# Altium project NeuroILO.PrjPcb
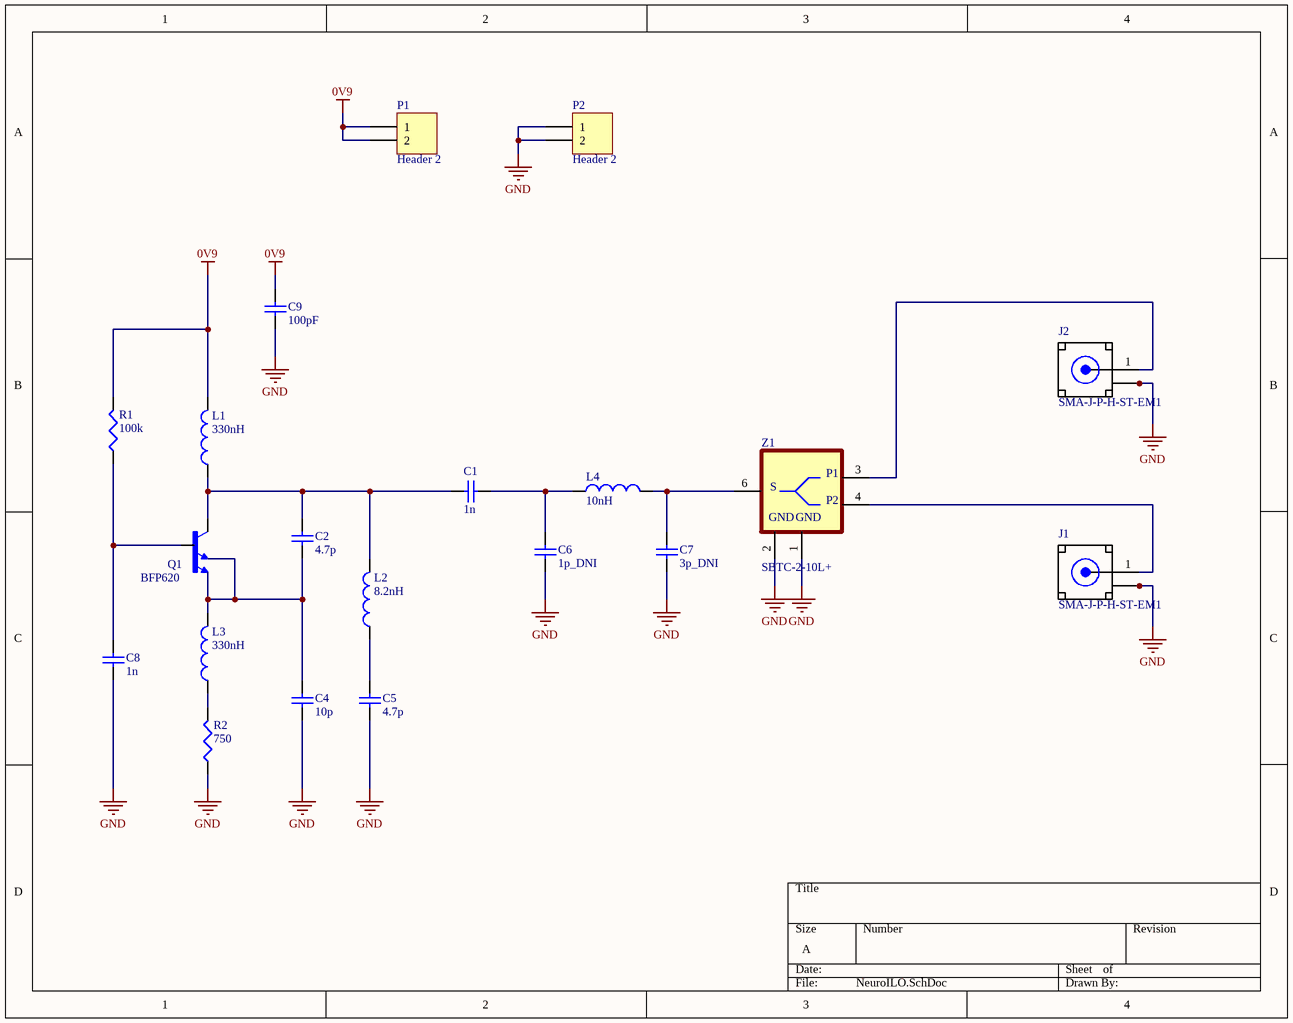
[diagram p0: NeuroILO.SchDoc]
1 sheet, 20 parts. Net scope: global (net labels, ports and power ports of the same name join across sheets).
Board file: neuroILO_C.PcbDoc

## Sheet NeuroILO.SchDoc
size A; SheetNumber: 1; SheetTotal: 1

### Parts
C1  1n  [SMD-0603]
C2  4.7p  [SMD-0603]
C4  10p  [SMD-0603]
C5  4.7p  [SMD-0603]
C6  1p_DNI  [SMD-0603]
C7  3p_DNI  [SMD-0603]
C8  1n  [SMD-0603]
C9  100pF  [SMD-0603]
J1  SMA-J-P-H-ST-EM1  [SMA-J-P-H-ST-EM1]
J2  SMA-J-P-H-ST-EM1  [SMA-J-P-H-ST-EM1]
L1  330nH  [SMD-0603]
L2  8.2nH  [SMD-0603]
L3  330nH  [SMD-0603]
L4  10nH  [SMD-0603]
P1  Header 2  [HDR1X2]
P2  Header 2  [HDR1X2]
Q1  BFP620  [SOT343]
R1  100k  [SMD-0603]
R2  750  [SMD-0603]
Z1  SBTC-2-10L+  [AT1029]

### Nets
0V9: C9.2 L1.2 P1.1 P1.2 R1.2
GND: C4.1 C5.1 C6.1 C7.1 C8.1 C9.1 J1.2_1(GND) J1.2_2(GND) J1.3_1(GND) J1.3_2(GND) J2.2_1(GND) J2.2_2(GND) J2.3_1(GND) J2.3_2(GND) P2.1 P2.2 R2.1 Z1.1(GND2) Z1.2(GND1)
NetC1_1: C1.1 C6.2 L4.1
NetC1_2: C1.2 C2.2 L1.1 L2.2 Q1.3(C)
NetC2_1: C2.1 C4.2 L3.2 Q1.2(E1) Q1.4(E2)
NetC5_2: C5.2 L2.1
NetC7_2: C7.2 L4.2 Z1.6(S)
NetC8_2: C8.2 Q1.1(B) R1.1
NetJ1_1: J1.1(SIGNAL) Z1.4(P2)
NetJ2_1: J2.1(SIGNAL) Z1.3(P1)
NetL3_1: L3.1 R2.2

### Notes on the sheet
- (in symbol SBTC-2-10L+) GND

### Library data of the parts
C1 C2 C4-C9 = CAP0603: Ceramic Capacitor 0603
J1 J2 = SMA-J-P-H-ST-EM1: Connector SMA F 50Ohm Solder ST Edge Mount Gold Over Nickel Tray; MF: Samtec; Price: None; SnapEDA_Link: https://www.snapeda.com/parts/SMA-J-P-H-ST-EM1/Samtec%20Inc./view-part/?ref=snap; MP: SMA-J-P-H-ST-EM1; Package: None; Availability: Unavailable; Value: *
L1-L4 = L0603: Inductor 0603
P1 P2 = Header 2: Header, 2-Pin; LatestRevisionDate: 17-Jul-2002; LatestRevisionNote: Re-released for DXP Platform.; Publisher: Altium Limited
Q1 = BFP620: Trans RF BJT NPN 2.3V 0.08A 185mW Automotive 4-Pin(3+Tab) SOT-343 T/R; MF: Infineon Technologies; Value: *; SnapEDA_Link: https://www.snapeda.com/parts/BFP620/Infineon+Technologies/view-part/?ref=snap; Check_prices: https://www.snapeda.com/parts/BFP620/Infineon+Technologies/view-part/?ref=eda; Purchase-URL: https://pricing.snapeda.com/search/part/BFP620/?ref=eda; Price: None; Availability: In Stock; Package: None; MP: BFP620
R1 R2 = RES0603: Resistor-0603
Z1 = SBTC-2-10L+: Power Divider, 2 Way-0 , 0.005 to 1.0 GHz, 50 ohms, SMT; MF: Mini-Circuits; Value: *; Price: None; Package: None; Check_prices: https://www.snapeda.com/parts/SBTC-2-10L+/Mini-Circuits/view-part/564803/?ref=eda; Availability: Warning; Purchase-URL: https://pricing.snapeda.com/search/part/SBTC-2-10L+/?ref=eda; MP: SBTC-2-10L+; SnapEDA_Link: https://www.snapeda.com/parts/SBTC-2-10L+/Mini-Circuits/view-part/564803/?ref=snap